# Altium project extension.PrjPcb (part 2 of 2)

## Sheet isolated_NO_contacts.SchDoc: foxBMS BMS-Extension
size A3; DocumentNumber: 13; SheetNumber: 13; SheetTotal: 14; Author: Fraunhofer IISB foxBMS Team; REL-DATE: 2017-05-16; VERSION: 1.0.2; GateName_1: G$1; SymbolName_1: FRAME_B_L; LibraryName: foxBMS_BMS-Master_V1.00_A; DeviceSetName: FRAME_B_L; GateName_2: G$2; SymbolName_2: DOCFIELD; SheetDescription: Isolated Normally Open Contacts
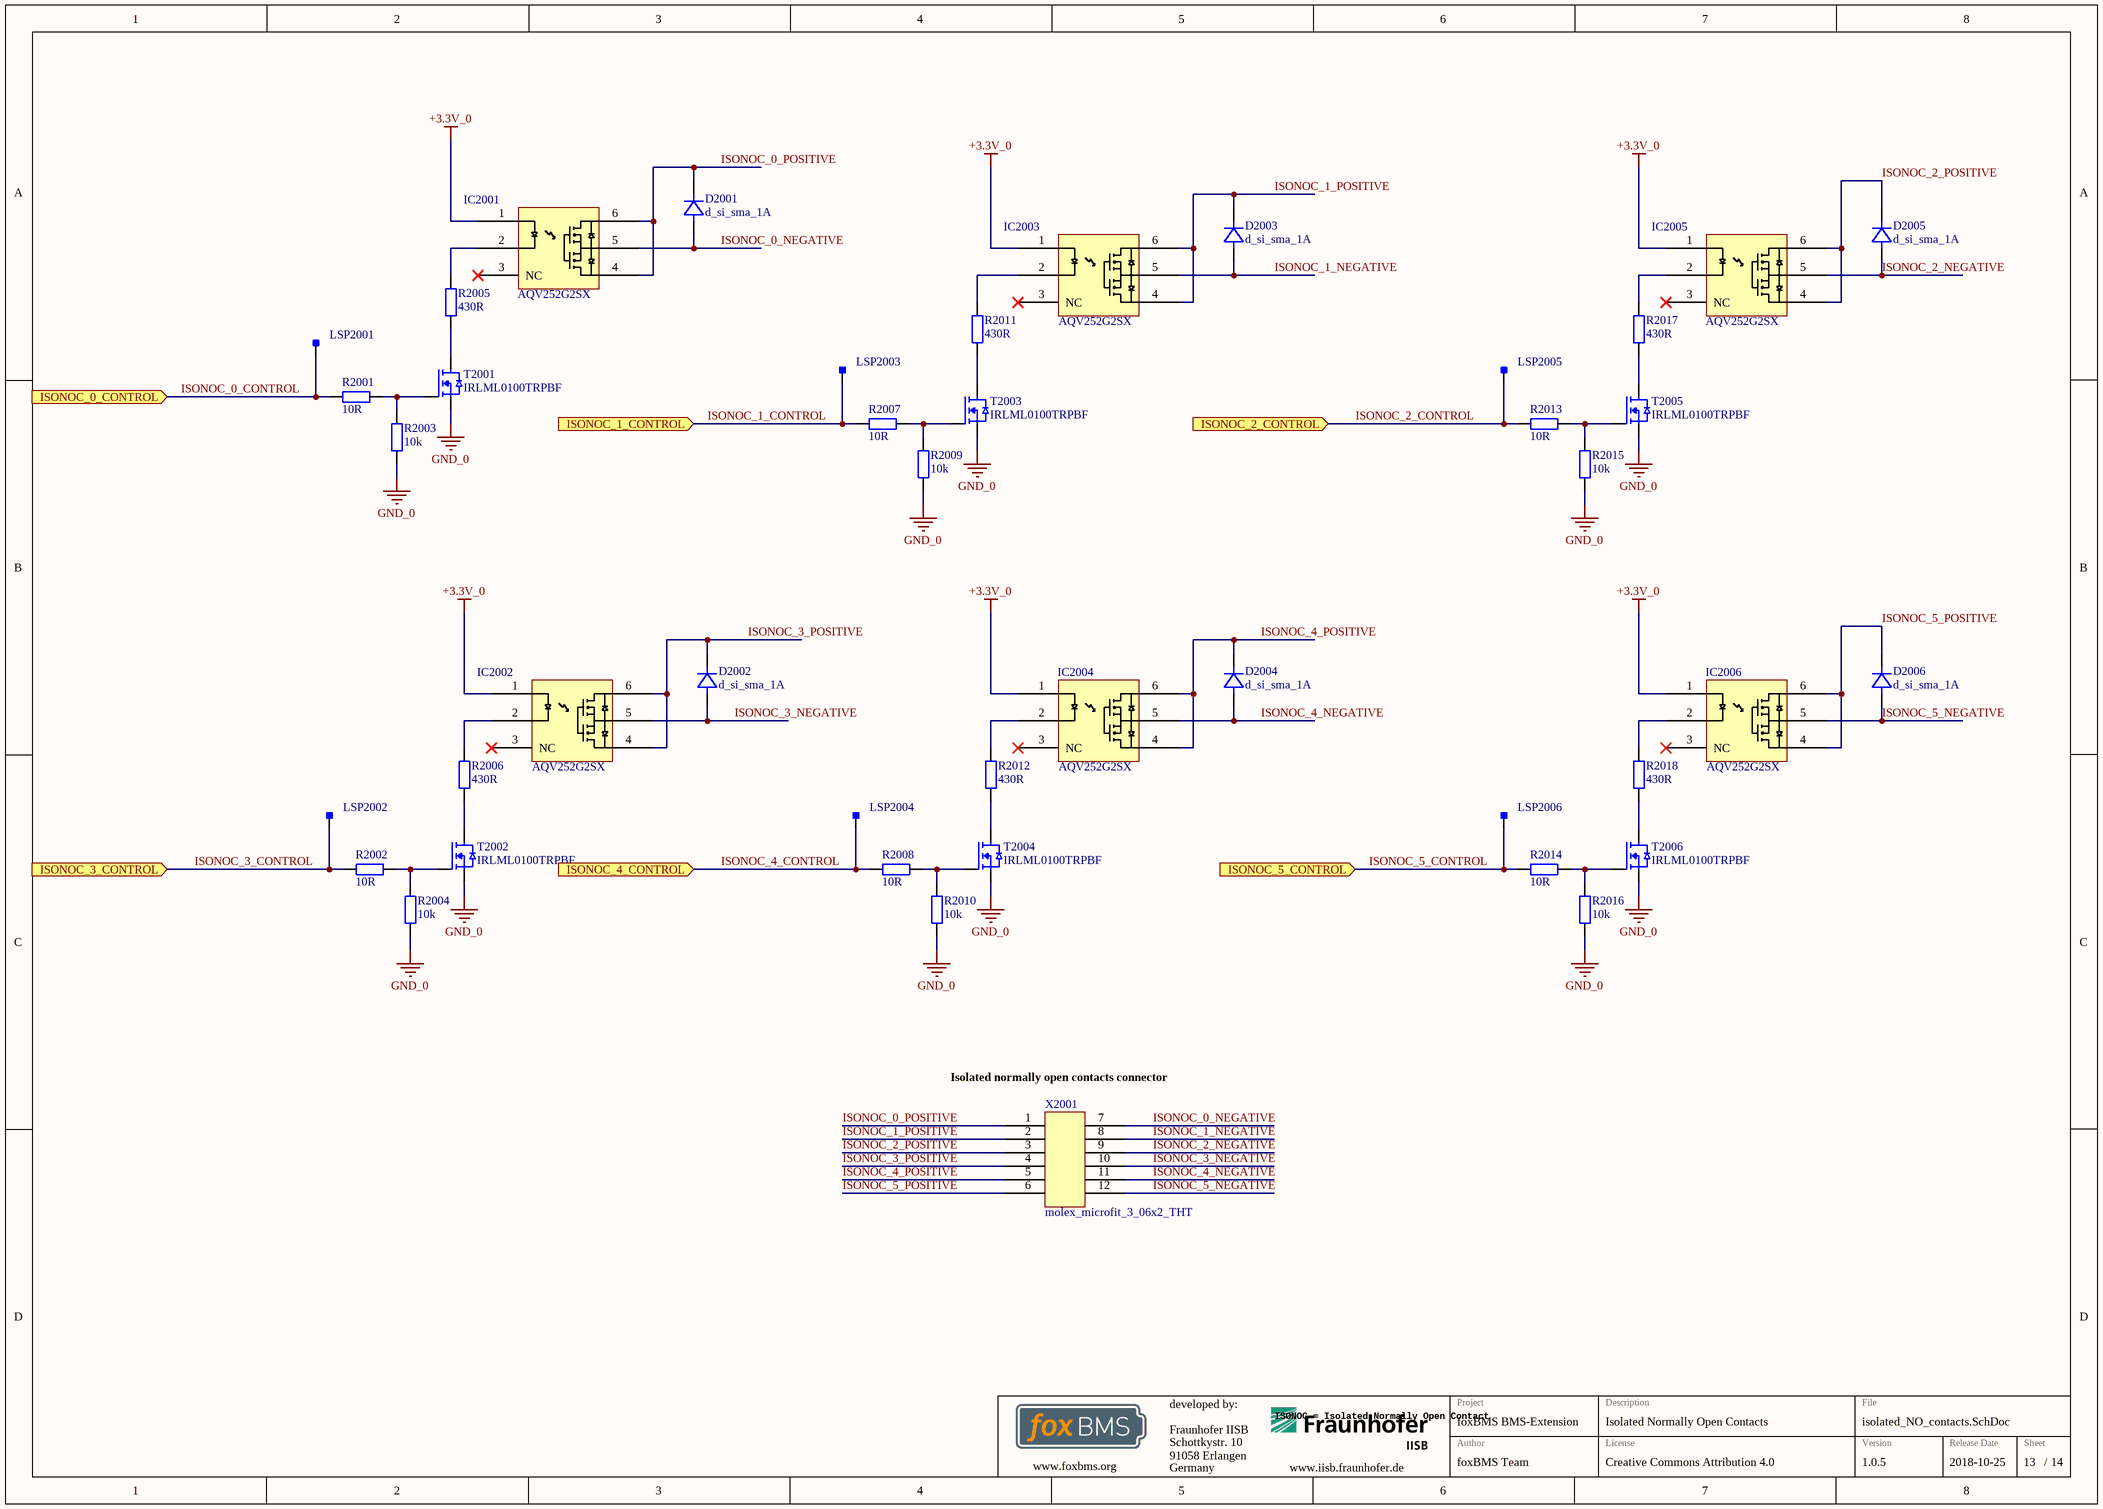
[diagram p7: isolated_NO_contacts.SchDoc]

### Parts
D2001  d_si_sma_1A  [DIOM4326X24N]
D2002  d_si_sma_1A  [DIOM4326X24N]
D2003  d_si_sma_1A  [DIOM4326X24N]
D2004  d_si_sma_1A  [DIOM4326X24N]
D2005  d_si_sma_1A  [DIOM4326X24N]
D2006  d_si_sma_1A  [DIOM4326X24N]
IC2001  AQV252G2SX  [SOP254P680X220-6N]
IC2002  AQV252G2SX  [SOP254P680X220-6N]
IC2003  AQV252G2SX  [SOP254P680X220-6N]
IC2004  AQV252G2SX  [SOP254P680X220-6N]
IC2005  AQV252G2SX  [SOP254P680X220-6N]
IC2006  AQV252G2SX  [SOP254P680X220-6N]
LSP2001  Testpoint_Square  [Testpoint_S1]  (value not drawn)  (no BOM)
LSP2002  Testpoint_Square  [Testpoint_S1]  (value not drawn)  (no BOM)
LSP2003  Testpoint_Square  [Testpoint_S1]  (value not drawn)  (no BOM)
LSP2004  Testpoint_Square  [Testpoint_S1]  (value not drawn)  (no BOM)
LSP2005  Testpoint_Square  [Testpoint_S1]  (value not drawn)  (no BOM)
LSP2006  Testpoint_Square  [Testpoint_S1]  (value not drawn)  (no BOM)
R2001  10R  [RESC1608X05N]
R2002  10R  [RESC1608X05N]
R2003  10k  [RESC1608X05N]
R2004  10k  [RESC1608X05N]
R2005  430R  [RESC1608X05N]
R2006  430R  [RESC1608X05N]
R2007  10R  [RESC1608X05N]
R2008  10R  [RESC1608X05N]
R2009  10k  [RESC1608X05N]
R2010  10k  [RESC1608X05N]
R2011  430R  [RESC1608X05N]
R2012  430R  [RESC1608X05N]
R2013  10R  [RESC1608X05N]
R2014  10R  [RESC1608X05N]
R2015  10k  [RESC1608X05N]
R2016  10k  [RESC1608X05N]
R2017  430R  [RESC1608X05N]
R2018  430R  [RESC1608X05N]
T2001  IRLML0100TRPBF  [SOT95P237X110-3N]
T2002  IRLML0100TRPBF  [SOT95P237X110-3N]
T2003  IRLML0100TRPBF  [SOT95P237X110-3N]
T2004  IRLML0100TRPBF  [SOT95P237X110-3N]
T2005  IRLML0100TRPBF  [SOT95P237X110-3N]
T2006  IRLML0100TRPBF  [SOT95P237X110-3N]
X2001  molex_microfit_3_06x2_THT  [MOLEX_MICROFIT_06x2_THT]

### Ports
ISONOC_0_CONTROL (in), ISONOC_1_CONTROL (in), ISONOC_2_CONTROL (in), ISONOC_3_CONTROL (in), ISONOC_4_CONTROL (in), ISONOC_5_CONTROL (in)

### Nets
+3.3V_0: IC2001.1 IC2002.1 IC2003.1 IC2004.1 IC2005.1 IC2006.1
GND_0: R2003.1 R2004.1 R2009.1 R2010.1 R2015.1 R2016.1 T2001.S T2002.S T2003.S T2004.S T2005.S T2006.S
ISONOC_0_CONTROL: LSP2001.1 R2001.2 ; port ISONOC_0_CONTROL
ISONOC_0_NEGATIVE: D2001.2(A) IC2001.5 X2001.7
ISONOC_0_POSITIVE: D2001.1(K) IC2001.4 IC2001.6 X2001.1
ISONOC_1_CONTROL: LSP2003.1 R2007.2 ; port ISONOC_1_CONTROL
ISONOC_1_NEGATIVE: D2003.2(A) IC2003.5 X2001.8
ISONOC_1_POSITIVE: D2003.1(K) IC2003.4 IC2003.6 X2001.2
ISONOC_2_CONTROL: LSP2005.1 R2013.2 ; port ISONOC_2_CONTROL
ISONOC_2_NEGATIVE: D2005.2(A) IC2005.5 X2001.9
ISONOC_2_POSITIVE: D2005.1(K) IC2005.4 IC2005.6 X2001.3
ISONOC_3_CONTROL: LSP2002.1 R2002.2 ; port ISONOC_3_CONTROL
ISONOC_3_NEGATIVE: D2002.2(A) IC2002.5 X2001.10
ISONOC_3_POSITIVE: D2002.1(K) IC2002.4 IC2002.6 X2001.4
ISONOC_4_CONTROL: LSP2004.1 R2008.2 ; port ISONOC_4_CONTROL
ISONOC_4_NEGATIVE: D2004.2(A) IC2004.5 X2001.11
ISONOC_4_POSITIVE: D2004.1(K) IC2004.4 IC2004.6 X2001.5
ISONOC_5_CONTROL: LSP2006.1 R2014.2 ; port ISONOC_5_CONTROL
ISONOC_5_NEGATIVE: D2006.2(A) IC2006.5 X2001.12
ISONOC_5_POSITIVE: D2006.1(K) IC2006.4 IC2006.6 X2001.6
NetIC2001_2: IC2001.2 R2005.2
NetIC2002_2: IC2002.2 R2006.2
NetIC2003_2: IC2003.2 R2011.2
NetIC2004_2: IC2004.2 R2012.2
NetIC2005_2: IC2005.2 R2017.2
NetIC2006_2: IC2006.2 R2018.2
NetR2001_1: R2001.1 R2003.2 T2001.G
NetR2002_1: R2002.1 R2004.2 T2002.G
NetR2005_1: R2005.1 T2001.D
NetR2006_1: R2006.1 T2002.D
NetR2007_1: R2007.1 R2009.2 T2003.G
NetR2008_1: R2008.1 R2010.2 T2004.G
NetR2011_1: R2011.1 T2003.D
NetR2012_1: R2012.1 T2004.D
NetR2013_1: R2013.1 R2015.2 T2005.G
NetR2014_1: R2014.1 R2016.2 T2006.G
NetR2017_1: R2017.1 T2005.D
NetR2018_1: R2018.1 T2006.D

Not connected (* = marked no-connect by the designer): IC2001 3(NC)*; IC2002 3(NC)*; IC2003 3(NC)*; IC2004 3(NC)*; IC2005 3(NC)*; IC2006 3(NC)*

### Notes on the sheet
- (near X2001) Isolated normally open contacts connector
- ISONOC = Isolated Normally Open Contact
- Fraunhofer IISB
- Schottkystr. 10
- developed by:
- 91058 Erlangen
- Germany
- Author
- Project
- License
- Description
- File
- Version
- Release Date
- Sheet
- www.foxbms.org
- www.iisb.fraunhofer.de
- foxBMS Team
- /

### Library data of the parts
D2001-D2006 = d_si_sma_1A: Standard Recovery Diode, 100 V, 1 A, Single, 1 V, 2 µs, 30 A; Part Name: GF1B; Manufacturer: ON Semiconductor; Breakdown Voltage: 100V; Continuous Forward Current: 1A; Part Number: d_si_sma_1A; Operating Temperature: -65°C - +175°C; ComponentLink1Description: Datasheet; ComponentLink1URL: http://www.farnell.com/datasheets/2303965.pdf; Supplier 1: Farnell; Supplier Part Number 1: 1467477
IC2001-IC2006 = AQV252G2SX: PhotoMOS Relay; Manufacturer: Panasonic; Part Number: AQV252G2SX; Part Name: AQV252G2SX; Operating Temperature: -40°C - +85°C; Supplier 1: Digikey; Supplier Part Number 1: 255-3594-1-ND; Supplier 2: Farnell; Supplier Part Number 2: 2302216
LSP2001-LSP2006 = Testpoint_Square: Testpoint, square; Part Number: Testpoint_Square
R2001 R2002 R2007 R2008 R2013 R2014 = gen_R_10R_0603: SMD Resistor 10R 0603; Tolerance: 1%; Power: 0.1W; Case EIA: 0603; Case Metric: 1608; Maximum Working Voltage: 75V; PnP Package: R_0603; Part Number: gen_R_10R_0603; Operating Temperature: -55°C - +155°C; Resistance: 10R; Series: E24, E96; PnP Value: 10R; Supplier 1: Farnell; Supplier Part Number 1: 2073361
R2003 R2004 R2009 R2010 R2015 R2016 = gen_R_10k_0603: as R803 on sheet CAN_1; Part Number: gen_R_10k_0603; Operating Temperature: -55°C - +155°C; Resistance: 10k; Series: E24, E96; PnP Value: 10k; Supplier 1: Farnell; Supplier Part Number 1: 2073349
R2005 R2006 R2011 R2012 R2017 R2018 = gen_R_430R_0603: SMD Resistor 430R 0603; Tolerance: 1%; Power: 0.1W; Case EIA: 0603; Case Metric: 1608; Maximum Working Voltage: 75V; PnP Package: R_0603; Part Number: gen_R_430R_0603; Operating Temperature: -55°C - +155°C; Resistance: 430R; Series: E24; PnP Value: 430R; Supplier 1: Farnell; Supplier Part Number 1: 2074259
T2001-T2006 = IRLML0100TRPBF: MOSFET-Transistor, n-Kanal, 1.6 A, 100 V, 0.178 ohm, 10 V, 2.5 V; Manufacturer: Infineon; Maximum Drain-Source Voltage: 100V; Maximum Continous Drain Current (25°C): 1.6A; R_DS(on): 190m; Total Gate Charge: 2.5nC; Part Number: IRLML0100TRPBF; Part Name: NMOS; Operating Temperature: -55°C - +150°C; ComponentLink1Description: Datasheet URL; ComponentLink1URL: http://www.farnell.com/datasheets/491501.pdf; Supplier 1: Farnell; Supplier Part Number 1: 1783928
X2001 = molex_microfit_3_06x2_THT: Micro-Fit 3.0 Right Angle Header, 3.00mm Pitch, Dual Row, 12 Circuits, with Snap-in Plastic Peg PCB Lock, Tin, Glow Wire Capable, Black, 43045-1200; Manufacturer: Molex; Circuits: 12; Rated Voltage: 600V; Rated Current: 8.5A; Part Number: molex_microfit_3_06x2_THT; Part Name: MicroFit; Operating Temperature: -40°C - +105°C; Supplier 1: Farnell; Supplier Part Number 1: 9732977

## Sheet FPGA_SPI_interface.SchDoc: foxBMS BMS-Extension
size A3; DocumentNumber: 14; SheetNumber: 14; SheetTotal: 14; Author: Fraunhofer IISB foxBMS Team; REL-DATE: 2017-05-16; VERSION: 1.0.2; GateName_1: G$1; SymbolName_1: FRAME_B_L; LibraryName: foxBMS_BMS-Master_V1.00_A; DeviceSetName: FRAME_B_L; GateName_2: G$2; SymbolName_2: DOCFIELD; SheetDescription: FPGA SPI Interface up to 45MHz
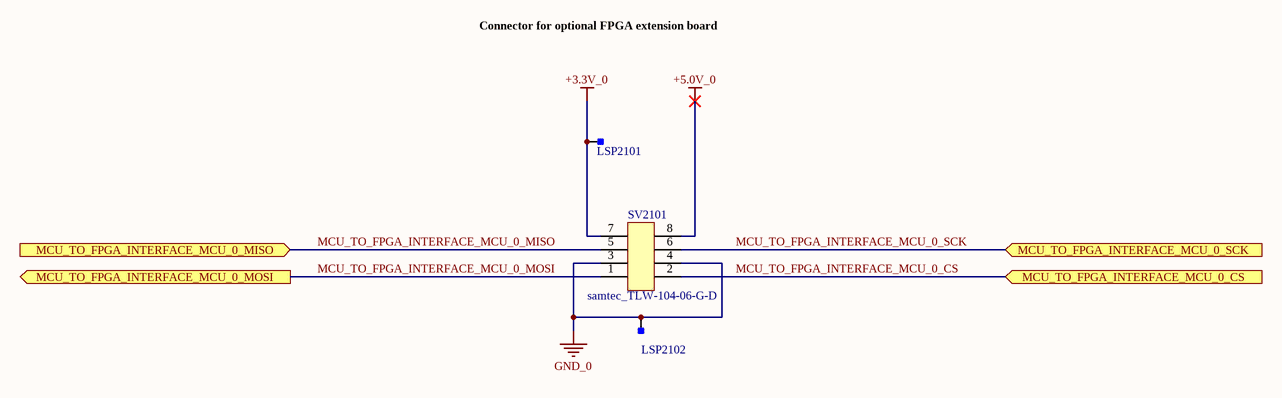
[diagram p8: FPGA_SPI_interface.SchDoc]

### Parts
LSP2101  Testpoint_Square  [Testpoint_S1]  (value not drawn)  (no BOM)
LSP2102  Testpoint_Square  [Testpoint_S1]  (value not drawn)  (no BOM)
SV2101  samtec_TLW-104-06-G-D  [Pinheader_2.54_2x4]

### Ports
MCU_TO_FPGA_INTERFACE_MCU_0_CS (in), MCU_TO_FPGA_INTERFACE_MCU_0_MISO (in), MCU_TO_FPGA_INTERFACE_MCU_0_MOSI (out), MCU_TO_FPGA_INTERFACE_MCU_0_SCK (in)

### Nets
+3.3V_0: LSP2101.1 SV2101.7
+5.0V_0: SV2101.8
GND_0: LSP2102.1 SV2101.3 SV2101.4
MCU_TO_FPGA_INTERFACE_MCU_0_CS: SV2101.2 ; port MCU_TO_FPGA_INTERFACE_MCU_0_CS
MCU_TO_FPGA_INTERFACE_MCU_0_MISO: SV2101.5 ; port MCU_TO_FPGA_INTERFACE_MCU_0_MISO
MCU_TO_FPGA_INTERFACE_MCU_0_MOSI: SV2101.1 ; port MCU_TO_FPGA_INTERFACE_MCU_0_MOSI
MCU_TO_FPGA_INTERFACE_MCU_0_SCK: SV2101.6 ; port MCU_TO_FPGA_INTERFACE_MCU_0_SCK

### Notes on the sheet
- Connector for optional FPGA extension board
- Fraunhofer IISB
- Schottkystr. 10
- developed by:
- 91058 Erlangen
- Germany
- Author
- Project
- License
- Description
- File
- Version
- Release Date
- Sheet
- www.foxbms.org
- www.iisb.fraunhofer.de
- foxBMS Team
- /

### Library data of the parts
LSP2101 LSP2102 = Testpoint_Square: Testpoint, square; Part Number: Testpoint_Square
SV2101 = samtec_TLW-104-06-G-D: Board-To-Board Connector, Vertical, Low Profile, 2.54 mm, 8 Contacts, Header, TLW Series, Through Hole, 2 Rows; Manufacturer: Samtec; Circuits: 8; Part Number: samtec_TLW-104-06-G-D; Part Name: TLW-104-06-G-D; Operating Temperature: -55°C - +125°C; ComponentLink1Description: Datasheet; ComponentLink1URL: http://suddendocs.samtec.com/catalog_english/tlw_th.pdf; Supplier 1: Digikey; Supplier Part Number 1: SAM1096-04-ND

## Sheet connectors_to_BMS_master.SchDoc: foxBMS BMS-Extension
size A3; DocumentNumber: 2; SheetNumber: 2; SheetTotal: 14; Author: Fraunhofer IISB foxBMS Team; REL-DATE: 2017-05-16; VERSION: 1.0.2; GateName_1: G$1; SymbolName_1: FRAME_B_L; LibraryName: foxBMS_BMS-Master_V1.00_A; DeviceSetName: FRAME_B_L; GateName_2: G$2; SymbolName_2: DOCFIELD; SheetDescription: Connectors to BMS-Master
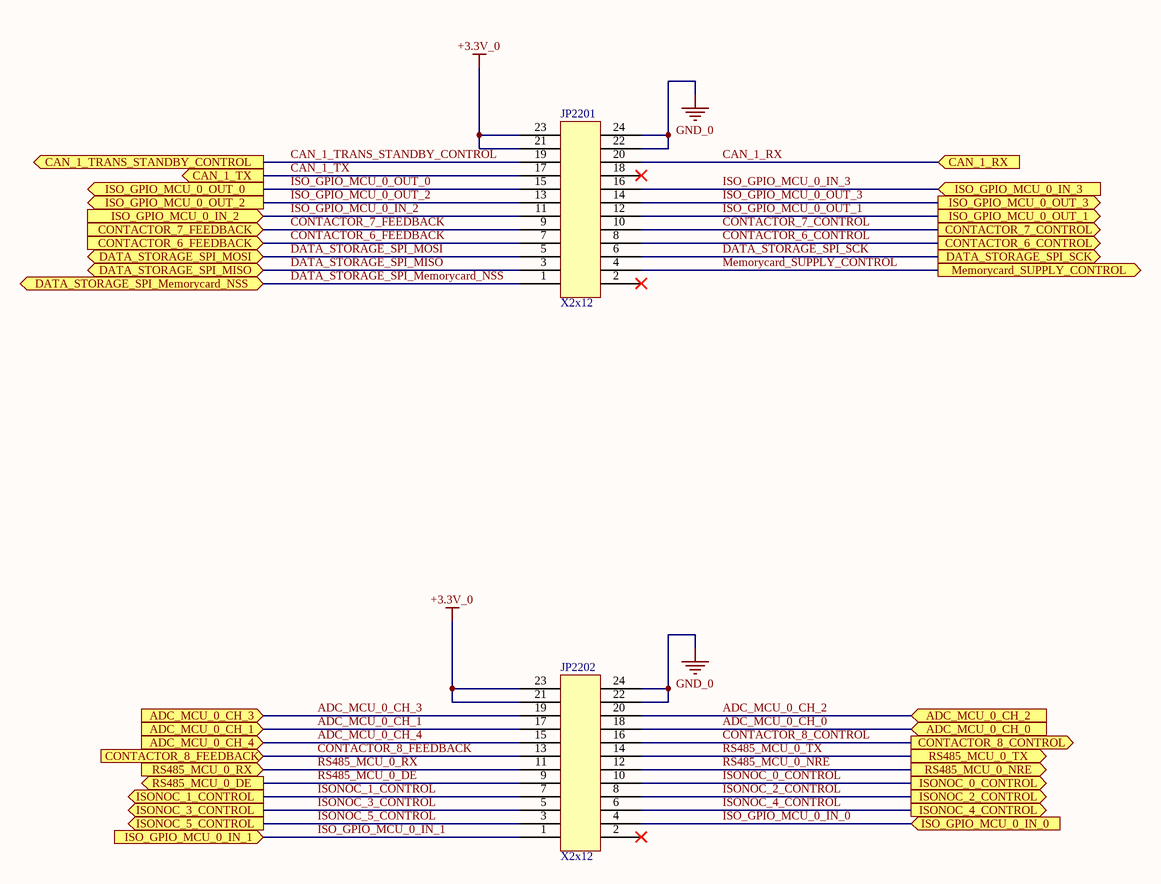
[diagram p9: connectors_to_BMS_master.SchDoc]

### Parts
JP2201  X2x12  [Pinheader_2.54_2x12]
JP2202  X2x12  [Pinheader_2.54_2x12]

### Ports
ADC_MCU_0_CH_0 (in), ADC_MCU_0_CH_1 (in), ADC_MCU_0_CH_2 (in), ADC_MCU_0_CH_3 (in), ADC_MCU_0_CH_4 (in), CAN_1_RX (in), CAN_1_TRANS_STANDBY_CONTROL (out), CAN_1_TX (out), CONTACTOR_6_CONTROL (out), CONTACTOR_6_FEEDBACK (in), CONTACTOR_7_CONTROL (out), CONTACTOR_7_FEEDBACK (in), CONTACTOR_8_CONTROL (out), CONTACTOR_8_FEEDBACK (in), DATA_STORAGE_SPI_Memorycard_NSS (bidir), DATA_STORAGE_SPI_MISO (bidir), DATA_STORAGE_SPI_MOSI (bidir), DATA_STORAGE_SPI_SCK (out), ISO_GPIO_MCU_0_IN_0 (in), ISO_GPIO_MCU_0_IN_1 (in), ISO_GPIO_MCU_0_IN_2 (in), ISO_GPIO_MCU_0_IN_3 (in), ISO_GPIO_MCU_0_OUT_0 (out), ISO_GPIO_MCU_0_OUT_1 (out), ISO_GPIO_MCU_0_OUT_2 (out), ISO_GPIO_MCU_0_OUT_3 (out), ISONOC_0_CONTROL (out), ISONOC_1_CONTROL (out), ISONOC_2_CONTROL (out), ISONOC_3_CONTROL (out), ISONOC_4_CONTROL (out), ISONOC_5_CONTROL (out), Memorycard_SUPPLY_CONTROL (out), RS485_MCU_0_DE (out), RS485_MCU_0_NRE (out), RS485_MCU_0_RX (in), RS485_MCU_0_TX (out)

### Nets
+3.3V_0: JP2201.21 JP2201.23 JP2202.21 JP2202.23
GND_0: JP2201.22 JP2201.24 JP2202.22 JP2202.24
ADC_MCU_0_CH_0: JP2202.18 ; port ADC_MCU_0_CH_0
ADC_MCU_0_CH_1: JP2202.17 ; port ADC_MCU_0_CH_1
ADC_MCU_0_CH_2: JP2202.20 ; port ADC_MCU_0_CH_2
ADC_MCU_0_CH_3: JP2202.19 ; port ADC_MCU_0_CH_3
ADC_MCU_0_CH_4: JP2202.15 ; port ADC_MCU_0_CH_4
CAN_1_RX: JP2201.20 ; port CAN_1_RX
CAN_1_TRANS_STANDBY_CONTROL: JP2201.19 ; port CAN_1_TRANS_STANDBY_CONTROL
CAN_1_TX: JP2201.17 ; port CAN_1_TX
CONTACTOR_6_CONTROL: JP2201.8 ; port CONTACTOR_6_CONTROL
CONTACTOR_6_FEEDBACK: JP2201.7 ; port CONTACTOR_6_FEEDBACK
CONTACTOR_7_CONTROL: JP2201.10 ; port CONTACTOR_7_CONTROL
CONTACTOR_7_FEEDBACK: JP2201.9 ; port CONTACTOR_7_FEEDBACK
CONTACTOR_8_CONTROL: JP2202.16 ; port CONTACTOR_8_CONTROL
CONTACTOR_8_FEEDBACK: JP2202.13 ; port CONTACTOR_8_FEEDBACK
DATA_STORAGE_SPI_Memorycard_NSS: JP2201.1 ; port DATA_STORAGE_SPI_Memorycard_NSS
DATA_STORAGE_SPI_MISO: JP2201.3 ; port DATA_STORAGE_SPI_MISO
DATA_STORAGE_SPI_MOSI: JP2201.5 ; port DATA_STORAGE_SPI_MOSI
DATA_STORAGE_SPI_SCK: JP2201.6 ; port DATA_STORAGE_SPI_SCK
ISO_GPIO_MCU_0_IN_0: JP2202.4 ; port ISO_GPIO_MCU_0_IN_0
ISO_GPIO_MCU_0_IN_1: JP2202.1 ; port ISO_GPIO_MCU_0_IN_1
ISO_GPIO_MCU_0_IN_2: JP2201.11 ; port ISO_GPIO_MCU_0_IN_2
ISO_GPIO_MCU_0_IN_3: JP2201.16 ; port ISO_GPIO_MCU_0_IN_3
ISO_GPIO_MCU_0_OUT_0: JP2201.15 ; port ISO_GPIO_MCU_0_OUT_0
ISO_GPIO_MCU_0_OUT_1: JP2201.12 ; port ISO_GPIO_MCU_0_OUT_1
ISO_GPIO_MCU_0_OUT_2: JP2201.13 ; port ISO_GPIO_MCU_0_OUT_2
ISO_GPIO_MCU_0_OUT_3: JP2201.14 ; port ISO_GPIO_MCU_0_OUT_3
ISONOC_0_CONTROL: JP2202.10 ; port ISONOC_0_CONTROL
ISONOC_1_CONTROL: JP2202.7 ; port ISONOC_1_CONTROL
ISONOC_2_CONTROL: JP2202.8 ; port ISONOC_2_CONTROL
ISONOC_3_CONTROL: JP2202.5 ; port ISONOC_3_CONTROL
ISONOC_4_CONTROL: JP2202.6 ; port ISONOC_4_CONTROL
ISONOC_5_CONTROL: JP2202.3 ; port ISONOC_5_CONTROL
Memorycard_SUPPLY_CONTROL: JP2201.4 ; port Memorycard_SUPPLY_CONTROL
RS485_MCU_0_DE: JP2202.9 ; port RS485_MCU_0_DE
RS485_MCU_0_NRE: JP2202.12 ; port RS485_MCU_0_NRE
RS485_MCU_0_RX: JP2202.11 ; port RS485_MCU_0_RX
RS485_MCU_0_TX: JP2202.14 ; port RS485_MCU_0_TX

Not connected (* = marked no-connect by the designer): JP2201 2* 18*; JP2202 2*

### Notes on the sheet
- Fraunhofer IISB
- Schottkystr. 10
- developed by:
- 91058 Erlangen
- Germany
- Author
- Project
- License
- Description
- File
- Version
- Release Date
- Sheet
- www.foxbms.org
- www.iisb.fraunhofer.de
- foxBMS Team
- /

### Library data of the parts
JP2201 JP2202 = samtec_TLW-112-06-G-D: Board-To-Board Connector, Vertical, Low Profile, 2.54 mm, 24 Contacts, Header, TLW Series, Through Hole, 2 Rows; Manufacturer: Samtec; Circuits: 24; Part Number: samtec_TLW-112-06-G-D; Part Name: TLW-112-06-G-D; Operating Temperature: -55°C - +125°C; ComponentLink1Description: Datasheet; ComponentLink1URL: http://suddendocs.samtec.com/catalog_english/tlw_th.pdf; Supplier 1: Digikey; Supplier Part Number 1: SAM1096-12-ND

## Sheet contactors_6_to_8.SchDoc
size A3; DocumentNumber: 3; SheetNumber: 3; SheetTotal: 14; SheetDescription: Contactors 6-8
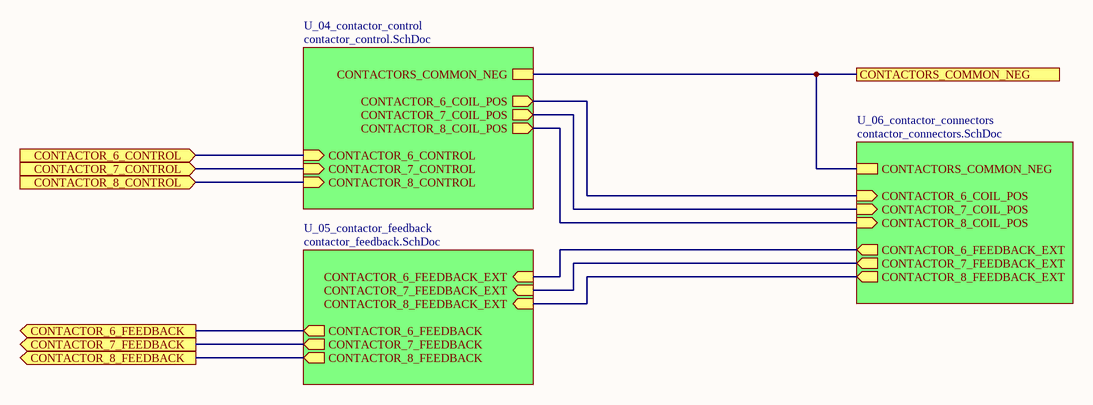
[diagram p10: contactors_6_to_8.SchDoc]

### Sub-sheets
U_04_contactor_control = contactor_control.SchDoc: CONTACTORS_COMMON_NEG, CONTACTOR_6_COIL_POS (out), CONTACTOR_7_COIL_POS (out), CONTACTOR_8_COIL_POS (out), CONTACTOR_6_CONTROL (in), CONTACTOR_7_CONTROL (in), CONTACTOR_8_CONTROL (in)
U_05_contactor_feedback = contactor_feedback.SchDoc: CONTACTOR_6_FEEDBACK_EXT (in), CONTACTOR_7_FEEDBACK_EXT (in), CONTACTOR_8_FEEDBACK_EXT (in), CONTACTOR_6_FEEDBACK (out), CONTACTOR_7_FEEDBACK (out), CONTACTOR_8_FEEDBACK (out)
U_06_contactor_connectors = contactor_connectors.SchDoc: CONTACTORS_COMMON_NEG, CONTACTOR_6_COIL_POS (in), CONTACTOR_6_FEEDBACK_EXT (out), CONTACTOR_7_COIL_POS (in), CONTACTOR_7_FEEDBACK_EXT (out), CONTACTOR_8_COIL_POS (in), CONTACTOR_8_FEEDBACK_EXT (out)

### Ports
CONTACTOR_6_CONTROL (in), CONTACTOR_6_FEEDBACK (out), CONTACTOR_7_CONTROL (in), CONTACTOR_7_FEEDBACK (out), CONTACTOR_8_CONTROL (in), CONTACTOR_8_FEEDBACK (out), CONTACTORS_COMMON_NEG

### Nets
CONTACTOR_6_COIL_POS: sheet U_04_contactor_control/CONTACTOR_6_COIL_POS, sheet U_06_contactor_connectors/CONTACTOR_6_COIL_POS
CONTACTOR_6_CONTROL: port CONTACTOR_6_CONTROL, sheet U_04_contactor_control/CONTACTOR_6_CONTROL
CONTACTOR_6_FEEDBACK: port CONTACTOR_6_FEEDBACK, sheet U_05_contactor_feedback/CONTACTOR_6_FEEDBACK
CONTACTOR_6_FEEDBACK_EXT: sheet U_05_contactor_feedback/CONTACTOR_6_FEEDBACK_EXT, sheet U_06_contactor_connectors/CONTACTOR_6_FEEDBACK_EXT
CONTACTOR_7_COIL_POS: sheet U_04_contactor_control/CONTACTOR_7_COIL_POS, sheet U_06_contactor_connectors/CONTACTOR_7_COIL_POS
CONTACTOR_7_CONTROL: port CONTACTOR_7_CONTROL, sheet U_04_contactor_control/CONTACTOR_7_CONTROL
CONTACTOR_7_FEEDBACK: port CONTACTOR_7_FEEDBACK, sheet U_05_contactor_feedback/CONTACTOR_7_FEEDBACK
CONTACTOR_7_FEEDBACK_EXT: sheet U_05_contactor_feedback/CONTACTOR_7_FEEDBACK_EXT, sheet U_06_contactor_connectors/CONTACTOR_7_FEEDBACK_EXT
CONTACTOR_8_COIL_POS: sheet U_04_contactor_control/CONTACTOR_8_COIL_POS, sheet U_06_contactor_connectors/CONTACTOR_8_COIL_POS
CONTACTOR_8_CONTROL: port CONTACTOR_8_CONTROL, sheet U_04_contactor_control/CONTACTOR_8_CONTROL
CONTACTOR_8_FEEDBACK: port CONTACTOR_8_FEEDBACK, sheet U_05_contactor_feedback/CONTACTOR_8_FEEDBACK
CONTACTOR_8_FEEDBACK_EXT: sheet U_05_contactor_feedback/CONTACTOR_8_FEEDBACK_EXT, sheet U_06_contactor_connectors/CONTACTOR_8_FEEDBACK_EXT
CONTACTORS_COMMON_NEG: port CONTACTORS_COMMON_NEG, sheet U_04_contactor_control/CONTACTORS_COMMON_NEG, sheet U_06_contactor_connectors/CONTACTORS_COMMON_NEG

### Notes on the sheet
- Fraunhofer IISB
- Schottkystr. 10
- developed by:
- 91058 Erlangen
- Germany
- Author
- Project
- License
- Description
- File
- Version
- Release Date
- Sheet
- www.foxbms.org
- www.iisb.fraunhofer.de
- foxBMS Team
- /

## Sheet contactor_control.SchDoc: foxBMS BMS-Extension
size A3; DocumentNumber: 4; SheetNumber: 4; SheetTotal: 14; Author: Fraunhofer IISB foxBMS Team; REL-DATE: 2017-05-16; VERSION: 1.0.2; GateName_1: G$1; SymbolName_1: FRAME_B_L; LibraryName: foxBMS_BMS-Master_V1.00_A; DeviceSetName: FRAME_B_L; GateName_2: G$2; SymbolName_2: DOCFIELD; SheetDescription: Contactor Control
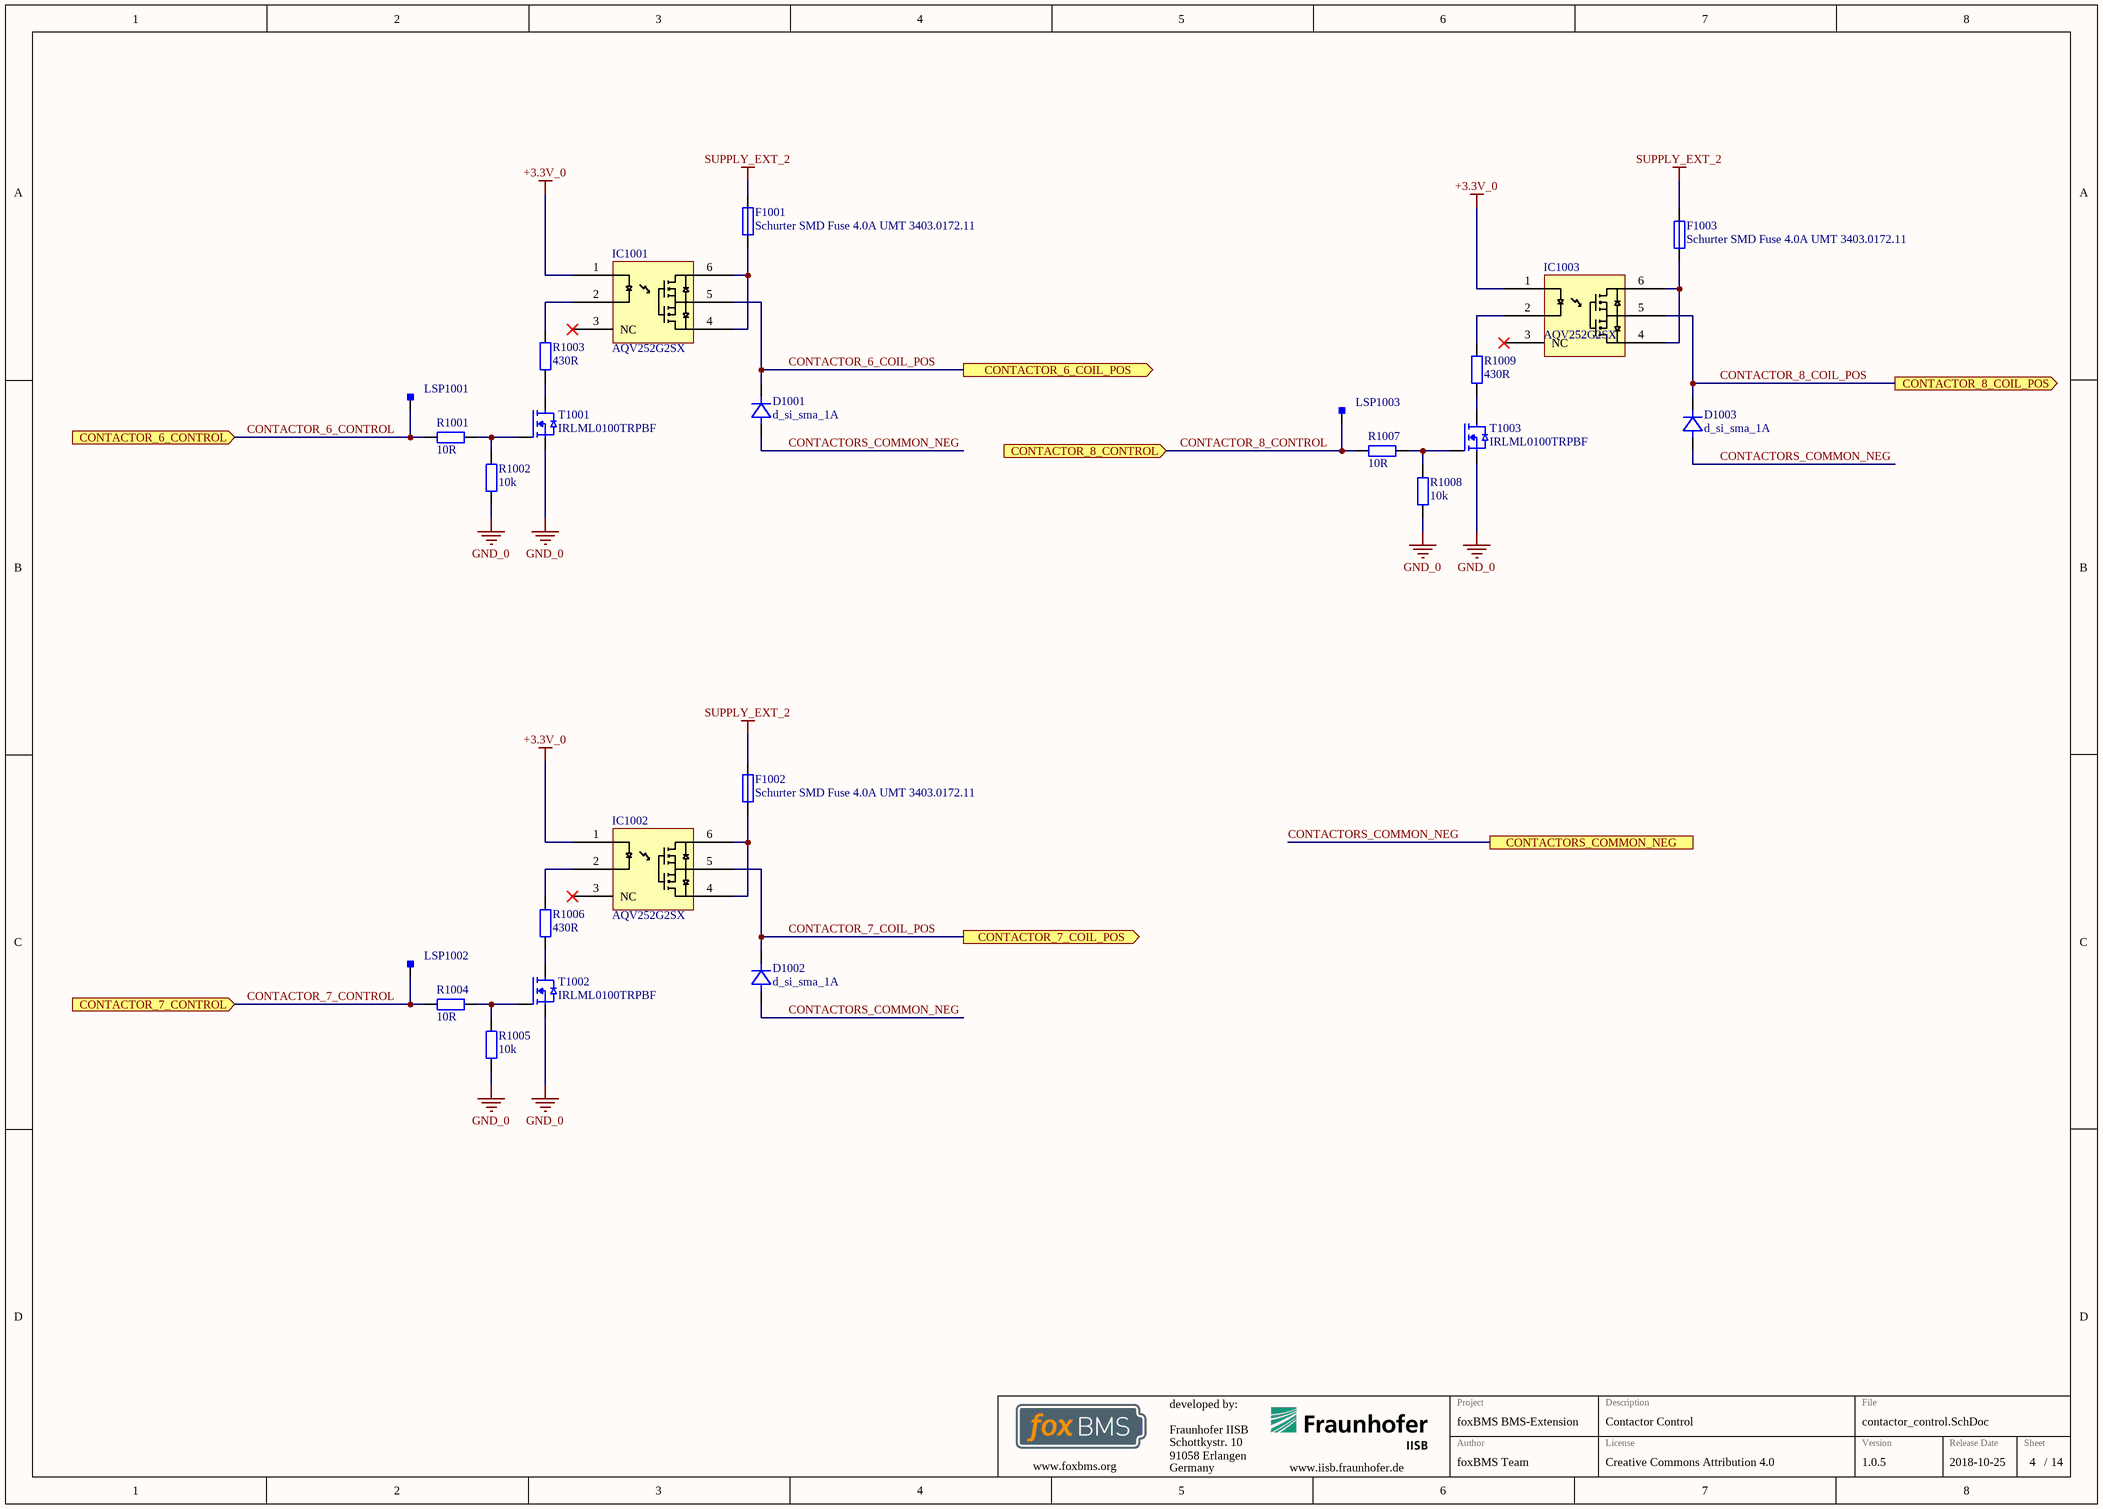
[diagram p11: contactor_control.SchDoc]

### Parts
D1001  d_si_sma_1A  [DIOM4326X24N]
D1002  d_si_sma_1A  [DIOM4326X24N]
D1003  d_si_sma_1A  [DIOM4326X24N]
F1001  Schurter SMD Fuse 4.0A UMT 3403.0172.11  [Schurter_UMT_250]
F1002  Schurter SMD Fuse 4.0A UMT 3403.0172.11  [Schurter_UMT_250]
F1003  Schurter SMD Fuse 4.0A UMT 3403.0172.11  [Schurter_UMT_250]
IC1001  AQV252G2SX  [SOP254P680X220-6N]
IC1002  AQV252G2SX  [SOP254P680X220-6N]
IC1003  AQV252G2SX  [SOP254P680X220-6N]
LSP1001  Testpoint_Square  [Testpoint_S1]  (value not drawn)  (no BOM)
LSP1002  Testpoint_Square  [Testpoint_S1]  (value not drawn)  (no BOM)
LSP1003  Testpoint_Square  [Testpoint_S1]  (value not drawn)  (no BOM)
R1001  10R  [RESC1608X05N]
R1002  10k  [RESC1608X05N]
R1003  430R  [RESC1608X05N]
R1004  10R  [RESC1608X05N]
R1005  10k  [RESC1608X05N]
R1006  430R  [RESC1608X05N]
R1007  10R  [RESC1608X05N]
R1008  10k  [RESC1608X05N]
R1009  430R  [RESC1608X05N]
T1001  IRLML0100TRPBF  [SOT95P237X110-3N]
T1002  IRLML0100TRPBF  [SOT95P237X110-3N]
T1003  IRLML0100TRPBF  [SOT95P237X110-3N]

### Ports
CONTACTOR_6_COIL_POS (out), CONTACTOR_6_CONTROL (in), CONTACTOR_7_COIL_POS (out), CONTACTOR_7_CONTROL (in), CONTACTOR_8_COIL_POS (out), CONTACTOR_8_CONTROL (in), CONTACTORS_COMMON_NEG

### Nets
+3.3V_0: IC1001.1 IC1002.1 IC1003.1
GND_0: R1002.1 R1005.1 R1008.1 T1001.S T1002.S T1003.S
SUPPLY_EXT_2: F1001.2 F1002.2 F1003.2
CONTACTOR_6_COIL_POS: D1001.1(K) IC1001.5 ; port CONTACTOR_6_COIL_POS
CONTACTOR_6_CONTROL: LSP1001.1 R1001.2 ; port CONTACTOR_6_CONTROL
CONTACTOR_7_COIL_POS: D1002.1(K) IC1002.5 ; port CONTACTOR_7_COIL_POS
CONTACTOR_7_CONTROL: LSP1002.1 R1004.2 ; port CONTACTOR_7_CONTROL
CONTACTOR_8_COIL_POS: D1003.1(K) IC1003.5 ; port CONTACTOR_8_COIL_POS
CONTACTOR_8_CONTROL: LSP1003.1 R1007.2 ; port CONTACTOR_8_CONTROL
CONTACTORS_COMMON_NEG: D1001.2(A) D1002.2(A) D1003.2(A) ; port CONTACTORS_COMMON_NEG
NetF1001_1: F1001.1 IC1001.4 IC1001.6
NetF1002_1: F1002.1 IC1002.4 IC1002.6
NetF1003_1: F1003.1 IC1003.4 IC1003.6
NetIC1001_2: IC1001.2 R1003.2
NetIC1002_2: IC1002.2 R1006.2
NetIC1003_2: IC1003.2 R1009.2
NetR1001_1: R1001.1 R1002.2 T1001.G
NetR1003_1: R1003.1 T1001.D
NetR1004_1: R1004.1 R1005.2 T1002.G
NetR1006_1: R1006.1 T1002.D
NetR1007_1: R1007.1 R1008.2 T1003.G
NetR1009_1: R1009.1 T1003.D

Not connected (* = marked no-connect by the designer): IC1001 3(NC)*; IC1002 3(NC)*; IC1003 3(NC)*

### Notes on the sheet
- Fraunhofer IISB
- Schottkystr. 10
- developed by:
- 91058 Erlangen
- Germany
- Author
- Project
- License
- Description
- File
- Version
- Release Date
- Sheet
- www.foxbms.org
- www.iisb.fraunhofer.de
- foxBMS Team
- /

### Library data of the parts
D1001-D1003 = d_si_sma_1A: as D2001 on sheet isolated_NO_contacts; Part Number: d_si_sma_1A; Operating Temperature: -65°C - +175°C; ComponentLink1Description: Datasheet; ComponentLink1URL: http://www.farnell.com/datasheets/2303965.pdf; Supplier 1: Farnell; Supplier Part Number 1: 1467477
F1001-F1003 = fuse_4A_3403.0172.11: Part Number: fuse_4A_3403.0172.11; Manufacturer: Schurter; Operating Temperature: -55°C - +125°C; ComponentLink1Description: Catalog Page Digikey; ComponentLink1URL: http://dkc3.digikey.com/PDF/DE2011-DE/P2352.pdf; Supplier 1: Digikey; Supplier Part Number 1: 486-1253-ND; Supplier 2: Mouser; Supplier Part Number 2: 693-3403.0172.11
IC1001-IC1003 = AQV252G2SX: PhotoMOS Relay; Manufacturer: Panasonic; Part Number: AQV252G2SX; Part Name: AQV252G2SX; Operating Temperature: -40°C - +85°C; Supplier 1: Digikey; Supplier Part Number 1: 255-3594-1-ND; Supplier 2: Farnell; Supplier Part Number 2: 2302216
LSP1001-LSP1003 = Testpoint_Square: Testpoint, square; Part Number: Testpoint_Square
R1001 R1004 R1007 = gen_R_10R_0603: as R2001 on sheet isolated_NO_contacts; Part Number: gen_R_10R_0603; Operating Temperature: -55°C - +155°C; Resistance: 10R; Series: E24, E96; PnP Value: 10R; Supplier 1: Farnell; Supplier Part Number 1: 2073361
R1002 R1005 = gen_R_10k_0603: as R803 on sheet CAN_1; Part Number: gen_R_10k_0603; Operating Temperature: -55°C - +155°C; Resistance: 10k; Series: E24, E96; PnP Value: 10k; Supplier 1: Farnell; Supplier Part Number 1: 2073349
R1003 R1006 R1009 = gen_R_430R_0603: as R2005 on sheet isolated_NO_contacts; Part Number: gen_R_430R_0603; Operating Temperature: -55°C - +155°C; Resistance: 430R; Series: E24; PnP Value: 430R; Supplier 1: Farnell; Supplier Part Number 1: 2074259
R1008 = gen_R_10k_0603: SMD Resistor 10k 0603; Power: 0.1W; Case EIA: 0603; Case Metric: 1608; PnP Package: R_0603; Tolerance: 1%; Maximum Working Voltage: 75V; Part Number: gen_R_10k_0603; Operating Temperature: -55°C - +155°C; Resistance: 10k; Series: E24, E96; PnP Value: 10k; Supplier 1: Farnell; Supplier Part Number 1: 2073349
T1001-T1003 = IRLML0100TRPBF: as T2001 on sheet isolated_NO_contacts; Part Number: IRLML0100TRPBF; Part Name: NMOS; Operating Temperature: -55°C - +150°C; ComponentLink1Description: Datasheet URL; ComponentLink1URL: http://www.farnell.com/datasheets/491501.pdf; Supplier 1: Farnell; Supplier Part Number 1: 1783928

## Sheet contactor_feedback.SchDoc: foxBMS BMS-Extension
size A3; DocumentNumber: 5; SheetNumber: 5; SheetTotal: 14; Author: Fraunhofer IISB foxBMS Team; REL-DATE: 2017-05-16; VERSION: 1.0.2; GateName_1: G$1; SymbolName_1: FRAME_B_L; LibraryName: foxBMS_BMS-Master_V1.00_A; DeviceSetName: FRAME_B_L; GateName_2: G$2; SymbolName_2: DOCFIELD; SheetDescription: Contactor Feedback
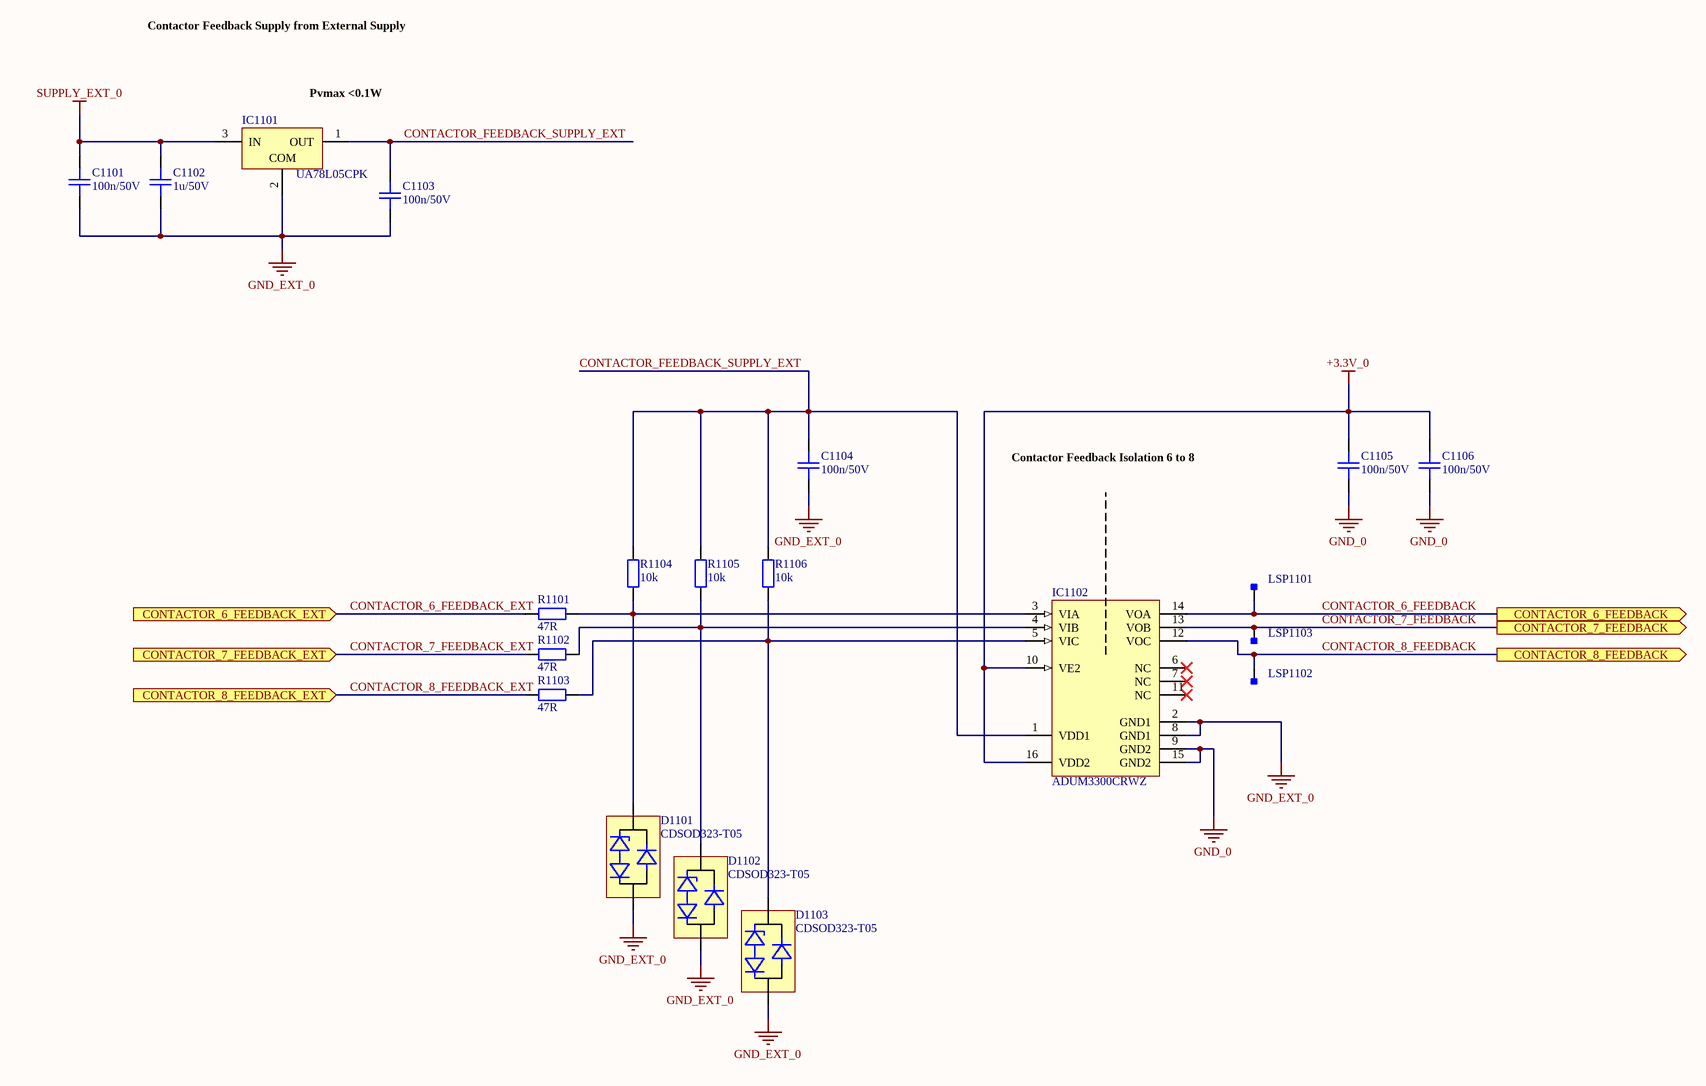
[diagram p12: contactor_feedback.SchDoc]

### Parts
C1101  100n/50V  [CAPC1608X08N]
C1102  1u/50V  [CAPC1608X08N]
C1103  100n/50V  [CAPC1608X08N]
C1104  100n/50V  [CAPC1608X08N]
C1105  100n/50V  [CAPC1608X08N]
C1106  100n/50V  [CAPC1608X08N]
D1101  CDSOD323-T05  [SODFL250X110-2N]
D1102  CDSOD323-T05  [SODFL250X110-2N]
D1103  CDSOD323-T05  [SODFL250X110-2N]
IC1101  UA78L05CPK  [PK0003A_L]
IC1102  ADUM3300CRWZ  [ADI-RW-16_L]
LSP1101  Testpoint_Square  [Testpoint_S1]  (value not drawn)  (no BOM)
LSP1102  Testpoint_Square  [Testpoint_S1]  (value not drawn)  (no BOM)
LSP1103  Testpoint_Square  [Testpoint_S1]  (value not drawn)  (no BOM)
R1101  47R  [RESC1608X05N]
R1102  47R  [RESC1608X05N]
R1103  47R  [RESC1608X05N]
R1104  10k  [RESC1608X05N]
R1105  10k  [RESC1608X05N]
R1106  10k  [RESC1608X05N]

### Ports
CONTACTOR_6_FEEDBACK (out), CONTACTOR_6_FEEDBACK_EXT (in), CONTACTOR_7_FEEDBACK (out), CONTACTOR_7_FEEDBACK_EXT (in), CONTACTOR_8_FEEDBACK (out), CONTACTOR_8_FEEDBACK_EXT (in)

### Nets
+3.3V_0: C1105.1 C1106.1 IC1102.10(VE2) IC1102.16(VDD2)
GND_0: C1105.2 C1106.2 IC1102.9(GND2) IC1102.15(GND2)
GND_EXT_0: C1101.2 C1102.2 C1103.2 C1104.2 D1101.2(A) D1102.2(A) D1103.2(A) IC1101.2(COM) IC1102.2(GND1) IC1102.8(GND1)
SUPPLY_EXT_0: C1101.1 C1102.1 IC1101.3(IN)
CONTACTOR_6_FEEDBACK: IC1102.14(VOA) LSP1101.1 ; port CONTACTOR_6_FEEDBACK
CONTACTOR_6_FEEDBACK_EXT: R1101.2 ; port CONTACTOR_6_FEEDBACK_EXT
CONTACTOR_7_FEEDBACK: IC1102.13(VOB) LSP1103.1 ; port CONTACTOR_7_FEEDBACK
CONTACTOR_7_FEEDBACK_EXT: R1102.2 ; port CONTACTOR_7_FEEDBACK_EXT
CONTACTOR_8_FEEDBACK: IC1102.12(VOC) LSP1102.1 ; port CONTACTOR_8_FEEDBACK
CONTACTOR_8_FEEDBACK_EXT: R1103.2 ; port CONTACTOR_8_FEEDBACK_EXT
CONTACTOR_FEEDBACK_SUPPLY_EXT: C1103.1 C1104.1 IC1101.1(OUT) IC1102.1(VDD1) R1104.2 R1105.2 R1106.2
NetD1101_1: D1101.1(K) IC1102.3(VIA) R1101.1 R1104.1
NetD1102_1: D1102.1(K) IC1102.4(VIB) R1102.1 R1105.1
NetD1103_1: D1103.1(K) IC1102.5(VIC) R1103.1 R1106.1

Not connected (* = marked no-connect by the designer): IC1102 6(NC)* 7(NC)* 11(NC)*

### Notes on the sheet
- Contactor Feedback Supply from External Supply
- (near IC1101) Pvmax <0.1W
- Contactor Feedback Isolation 6 to 8
- Fraunhofer IISB
- Schottkystr. 10
- developed by:
- 91058 Erlangen
- Germany
- Author
- Project
- License
- Description
- File
- Version
- Release Date
- Sheet
- www.foxbms.org
- www.iisb.fraunhofer.de
- foxBMS Team
- /

### Library data of the parts
C1101 C1103-C1106 = gen_C_ceramic_100n_50V_X7R_0603: MLCC; Capacitance: 100n; Rated Voltage: 50V; Dielectric: X7R; Case EIA: 0603; Case Metric: 1608; PnP Package: C_0603_10; PnP Value: 100n/50V/X7R; PnP equipped: x; Part Number: gen_C_ceramic_100n_50V_X7R_0603; Supplier 1: Farnell; Supplier Part Number 1: 2525267
C1102 = gen_C_ceramic_1u_50V_X7R_0603: MLCC; Capacitance: 1u; Rated Voltage: 50V; Dielectric: X7R; Tolerance: ± 10%; Case EIA: 0603; Case Metric: 1608; Part Number: gen_C_ceramic_1u_50V_X7R_0603; Operating Temperature: -55°C - +125°C; Supplier 1: Farnell; Supplier Part Number 1: 2779055
D1101-D1103 = CDSOD323-T05: TVS Diode, CDSOD323 Series, Unidirectional, 5 V, 18.3 V, SOD-323, 2 Pins; Manufacturer: Bourns; Breakdown Voltage: 6V; Part Number: CDSOD323-T05; Part Name: CDSOD323-T05; Operating Temperature: -55°C - +150°C; ComponentLink1Description: Datasheet; ComponentLink1URL: http://www.farnell.com/datasheets/1845299.pdf; Supplier 1: Farnell; Supplier Part Number 1: 2341914
IC1101 = CMP-2000-07341-1: Positive-Voltage Regulator, 100 mA, 0 to 125 degC, 3-Pin SOT-89 (PK), Green (RoHS & no Sb/Br), Tape and Reel; Manufacturer: TexasInstruments; Load Regulation: 60mV; Input Voltage MIN: 7V; Number of Outputs: 1; Input Voltage MAX: 20V; Output Type: Fixed; Output Current: 100mA; Output Voltage: 5V; PSRR / Ripple Rejection - Typ: 49dB; Line Regulation: 200mV; Mounting Style: SMD/SMT; Datasheet Version: Rev. U, 05/2011; Polarity: Positive; Minimum Operating Temperature: 0C; Package Reference: PK0003A; Brand: TexasInstruments; Packaging: Reel; Product Category: LinearVoltageRegulators; RoHS: True; Datasheet URL: http://www.ti.com/lit/ds/symlink/ua78l05.pdf; Package URL: http://www.ti.com/lit/ml/mhsi001b/mhsi001b.pdf; Series: UA78L05; Manufacturer URL: http://www.ti.com/; Package Description: 3-Pin Small Outline Transistor, Body 4.5 x 2.5 mm, Pitch 1.5 mm; Mounting Technology: SurfaceMount; Package / Case: SOT-89-4; Maximum Operating Temperature: +125C
IC1102 = CMP-0534-00476-1: Triple Channel Digital Isolator, Enhanced System-Level ESD Reliability, 2.5 KV rms Insulation Rating, 90 Mbps Data Rate, 32 ns Delay, Industrial, 16-pin SOIC (RW-16), Tube; Manufacturer: Analog Devices; Max Data Rate: 90Mbps; Insulation Rating (kVrms): 2.5; Max Operating Temp (degreesC): 105; ComponentLink3Description: Package Specification; ComponentLink4URL: Product URL:http://www.analog.com/en/interface-isolation/digital-isolators/adum3300/products/product.html; Code_JEDEC: MS-013-AA; PackageDescription: 16-Pin Standard Small Outline Package, Body 10.3 x 7.5 mm, Pitch 1.27 mm; ComponentLink4Description: URL Link1; ComponentLink1URL: http://www.analog.com/en/index.html; ComponentLink2URL: http://www.analog.com/static/imported-files/data_sheets/ADUM3300_3301.pdf; ComponentLink2Description: Datasheet; ComponentLink1Description: Manufacturer URL; PackageVersion: 032707-B, 03/2007; PackageReference: RW-16; PartNumber: ADUM3300CRWZ; Mounting Technology: Surface Mount; ComponentLink3URL: http://www.analog.com/static/imported-files/packages/PKG_PDF/SOIC_WIDE%20%28RW%29/RW_16.pdf; DatasheetVersion: Rev. B
LSP1101-LSP1103 = Testpoint_Square: Testpoint, square; Part Number: Testpoint_Square
R1101-R1103 = gen_R_47R_0603: SMD Resistor 47R 0603; Tolerance: 1%; Power: 0.1W; Case EIA: 0603; Case Metric: 1608; Maximum Working Voltage: 75V; PnP Package: R_0603; Part Number: gen_R_47R_0603; Operating Temperature: -55°C - +155°C; Resistance: 47R; Series: E24; PnP Value: 47R; Supplier 1: Farnell; Supplier Part Number 1: 2303030
R1104-R1106 = gen_R_10k_0603: SMD Resistor 10k 0603; Tolerance: 1%; Power: 0.1W; Case EIA: 0603; Case Metric: 1608; Maximum Working Voltage: 75V; PnP Package: R_0603; Part Number: gen_R_10k_0603; Operating Temperature: -55°C - +155°C; Resistance: 10k; Series: E24, E96; PnP Value: 10k; Supplier 1: Farnell; Supplier Part Number 1: 2073349

## Sheet contactor_connectors.SchDoc: foxBMS BMS-Extension
size A3; DocumentNumber: 6; SheetNumber: 6; SheetTotal: 14; Author: Fraunhofer IISB foxBMS Team; REL-DATE: 2017-05-16; VERSION: 1.0.2; GateName_1: G$1; SymbolName_1: FRAME_B_L; LibraryName: foxBMS_BMS-Master_V1.00_A; DeviceSetName: FRAME_B_L; GateName_2: G$2; SymbolName_2: DOCFIELD; SheetDescription: Contactor Connectors
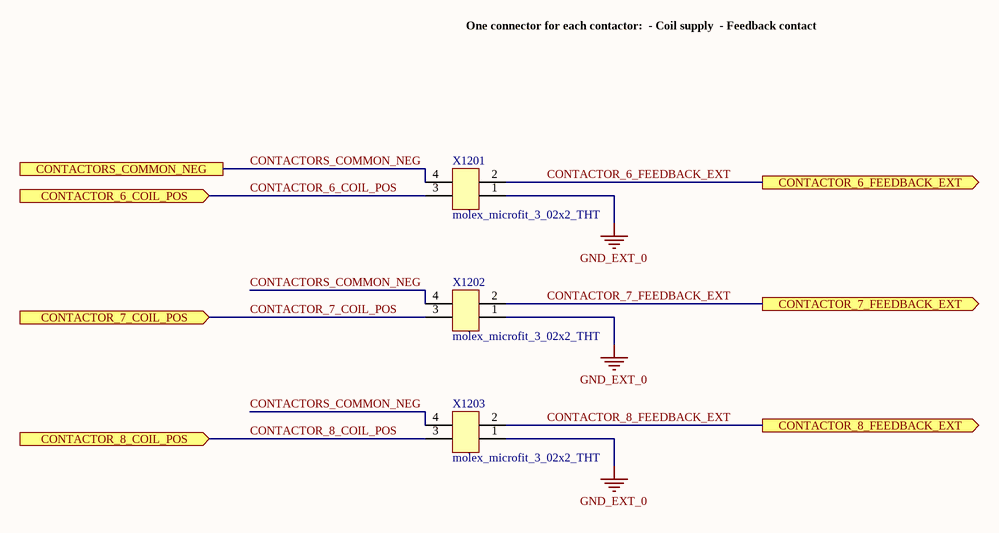
[diagram p13: contactor_connectors.SchDoc]

### Parts
X1201  molex_microfit_3_02x2_THT  [MOLEX_MICROFIT_02x2_THT]
X1202  molex_microfit_3_02x2_THT  [MOLEX_MICROFIT_02x2_THT]
X1203  molex_microfit_3_02x2_THT  [MOLEX_MICROFIT_02x2_THT]

### Ports
CONTACTOR_6_COIL_POS (in), CONTACTOR_6_FEEDBACK_EXT (out), CONTACTOR_7_COIL_POS (in), CONTACTOR_7_FEEDBACK_EXT (out), CONTACTOR_8_COIL_POS (in), CONTACTOR_8_FEEDBACK_EXT (out), CONTACTORS_COMMON_NEG

### Nets
GND_EXT_0: X1201.1 X1202.1 X1203.1
CONTACTOR_6_COIL_POS: X1201.3 ; port CONTACTOR_6_COIL_POS
CONTACTOR_6_FEEDBACK_EXT: X1201.2 ; port CONTACTOR_6_FEEDBACK_EXT
CONTACTOR_7_COIL_POS: X1202.3 ; port CONTACTOR_7_COIL_POS
CONTACTOR_7_FEEDBACK_EXT: X1202.2 ; port CONTACTOR_7_FEEDBACK_EXT
CONTACTOR_8_COIL_POS: X1203.3 ; port CONTACTOR_8_COIL_POS
CONTACTOR_8_FEEDBACK_EXT: X1203.2 ; port CONTACTOR_8_FEEDBACK_EXT
CONTACTORS_COMMON_NEG: X1201.4 X1202.4 X1203.4 ; port CONTACTORS_COMMON_NEG

### Notes on the sheet
- One connector for each contactor:
  - Coil supply
  - Feedback contact
- Fraunhofer IISB
- Schottkystr. 10
- developed by:
- 91058 Erlangen
- Germany
- Author
- Project
- License
- Description
- File
- Version
- Release Date
- Sheet
- www.foxbms.org
- www.iisb.fraunhofer.de
- foxBMS Team
- /

### Library data of the parts
X1201-X1203 = molex_microfit_3_02x2_THT: Micro-Fit 3.0 Right Angle Header, 3.00mm Pitch, Dual Row, 4 Circuits, with Snap-in Plastic Peg PCB Lock, Tin, Glow Wire Capable, Black, 43045-0400; Manufacturer: Molex; Circuits: 4; Rated Voltage: 600V; Rated Current: 8.5A; Part Number: molex_microfit_3_02x2_THT; Part Name: MicroFit; Operating Temperature: -40°C - +105°C; Supplier 1: Farnell; Supplier Part Number 1: 9733019

## Nets that join several sheets
+3.3V_0: CAN_1 (C807.2 IC803.1 R804.1), isolated_rs485 (C1306.1 IC1303.1 IC1303.7), memorycard (R1501.2 T1501.2), analog_inputs_not_isolated (C1703.1 C1704.1 IC1701.3 IC1701.4), iso_GPIO_4in_4out (6 pins), isolated_NO_contacts (6 pins), FPGA_SPI_interface (LSP2101.1 SV2101.7), connectors_to_BMS_master (JP2201.21 JP2201.23 JP2202.21 JP2202.23), contactor_control (IC1001.1 IC1002.1 IC1003.1), contactor_feedback (C1105.1 C1106.1 IC1102.10 IC1102.16)
GND_0: CAN_1 (6 pins), isolated_rs485 (C1306.2 IC1303.2 IC1303.8), memorycard (6 pins), analog_inputs_not_isolated (22 pins), iso_GPIO_4in_4out (6 pins), isolated_NO_contacts (12 pins), FPGA_SPI_interface (LSP2102.1 SV2101.3 SV2101.4), connectors_to_BMS_master (JP2201.22 JP2201.24 JP2202.22 JP2202.24), contactor_control (6 pins), contactor_feedback (C1105.2 C1106.2 IC1102.9 IC1102.15)
GND_EXT_0: interlock (SV901.8), iso_GPIO_4in_4out (20 pins), contactor_feedback (10 pins), contactor_connectors (X1201.1 X1202.1 X1203.1)
SUPPLY_EXT_0: interlock (SV901.5), iso_GPIO_4in_4out (C1901.1 C1902.1 IC1901.3), contactor_feedback (C1101.1 C1102.1 IC1101.3)
SUPPLY_EXT_2: interlock (SV901.1 SV901.3), contactor_control (F1001.2 F1002.2 F1003.2)
ADC_MCU_0_CH_0: analog_inputs_not_isolated (5 pins), connectors_to_BMS_master (JP2202.18)
ADC_MCU_0_CH_1: analog_inputs_not_isolated (5 pins), connectors_to_BMS_master (JP2202.17)
ADC_MCU_0_CH_2: analog_inputs_not_isolated (5 pins), connectors_to_BMS_master (JP2202.20)
ADC_MCU_0_CH_3: analog_inputs_not_isolated (5 pins), connectors_to_BMS_master (JP2202.19)
ADC_MCU_0_CH_4: analog_inputs_not_isolated (5 pins), connectors_to_BMS_master (JP2202.15)
CAN_1_RX: CAN_1 (IC803.5 LSP806.1), connectors_to_BMS_master (JP2201.20)
CAN_1_TRANS_STANDBY_CONTROL: CAN_1 (R806.2), connectors_to_BMS_master (JP2201.19)
CAN_1_TX: CAN_1 (IC803.3 LSP805.1), connectors_to_BMS_master (JP2201.17)
CONTACTOR_6_COIL_POS: contactor_control (D1001.1 IC1001.5), contactor_connectors (X1201.3)
CONTACTOR_6_CONTROL: connectors_to_BMS_master (JP2201.8), contactor_control (LSP1001.1 R1001.2)
CONTACTOR_6_FEEDBACK: connectors_to_BMS_master (JP2201.7), contactor_feedback (IC1102.14 LSP1101.1)
CONTACTOR_6_FEEDBACK_EXT: contactor_feedback (R1101.2), contactor_connectors (X1201.2)
CONTACTOR_7_COIL_POS: contactor_control (D1002.1 IC1002.5), contactor_connectors (X1202.3)
CONTACTOR_7_CONTROL: connectors_to_BMS_master (JP2201.10), contactor_control (LSP1002.1 R1004.2)
CONTACTOR_7_FEEDBACK: connectors_to_BMS_master (JP2201.9), contactor_feedback (IC1102.13 LSP1103.1)
CONTACTOR_7_FEEDBACK_EXT: contactor_feedback (R1102.2), contactor_connectors (X1202.2)
CONTACTOR_8_COIL_POS: contactor_control (D1003.1 IC1003.5), contactor_connectors (X1203.3)
CONTACTOR_8_CONTROL: connectors_to_BMS_master (JP2202.16), contactor_control (LSP1003.1 R1007.2)
CONTACTOR_8_FEEDBACK: connectors_to_BMS_master (JP2202.13), contactor_feedback (IC1102.12 LSP1102.1)
CONTACTOR_8_FEEDBACK_EXT: contactor_feedback (R1103.2), contactor_connectors (X1203.2)
CONTACTORS_COMMON_NEG: interlock (T901.4), contactor_control (D1001.2 D1002.2 D1003.2), contactor_connectors (X1201.4 X1202.4 X1203.4)
DATA_STORAGE_SPI_Memorycard_NSS: memorycard (LSP1502.1 R1506.1 SLOT1501.2), connectors_to_BMS_master (JP2201.1)
DATA_STORAGE_SPI_MISO: memorycard (LSP1505.1 R1507.1 SLOT1501.7), connectors_to_BMS_master (JP2201.3)
DATA_STORAGE_SPI_MOSI: memorycard (LSP1503.1 R1504.1 SLOT1501.3), connectors_to_BMS_master (JP2201.5)
DATA_STORAGE_SPI_SCK: memorycard (LSP1504.1 R1505.2 SLOT1501.5), connectors_to_BMS_master (JP2201.6)
ISO_GPIO_MCU_0_IN_0: iso_GPIO_4in_4out (IC1902.14 LSP1903.1), connectors_to_BMS_master (JP2202.4)
ISO_GPIO_MCU_0_IN_1: iso_GPIO_4in_4out (IC1902.13 LSP1901.1), connectors_to_BMS_master (JP2202.1)
ISO_GPIO_MCU_0_IN_2: iso_GPIO_4in_4out (IC1903.14 LSP1905.1), connectors_to_BMS_master (JP2201.11)
ISO_GPIO_MCU_0_IN_3: iso_GPIO_4in_4out (IC1903.13 LSP1907.1), connectors_to_BMS_master (JP2201.16)
ISO_GPIO_MCU_0_OUT_0: iso_GPIO_4in_4out (IC1902.12 LSP1904.1), connectors_to_BMS_master (JP2201.15)
ISO_GPIO_MCU_0_OUT_1: iso_GPIO_4in_4out (IC1902.11 LSP1902.1), connectors_to_BMS_master (JP2201.12)
ISO_GPIO_MCU_0_OUT_2: iso_GPIO_4in_4out (IC1903.12 LSP1906.1), connectors_to_BMS_master (JP2201.13)
ISO_GPIO_MCU_0_OUT_3: iso_GPIO_4in_4out (IC1903.11 LSP1908.1), connectors_to_BMS_master (JP2201.14)
ISONOC_0_CONTROL: isolated_NO_contacts (LSP2001.1 R2001.2), connectors_to_BMS_master (JP2202.10)
ISONOC_1_CONTROL: isolated_NO_contacts (LSP2003.1 R2007.2), connectors_to_BMS_master (JP2202.7)
ISONOC_2_CONTROL: isolated_NO_contacts (LSP2005.1 R2013.2), connectors_to_BMS_master (JP2202.8)
ISONOC_3_CONTROL: isolated_NO_contacts (LSP2002.1 R2002.2), connectors_to_BMS_master (JP2202.5)
ISONOC_4_CONTROL: isolated_NO_contacts (LSP2004.1 R2008.2), connectors_to_BMS_master (JP2202.6)
ISONOC_5_CONTROL: isolated_NO_contacts (LSP2006.1 R2014.2), connectors_to_BMS_master (JP2202.3)
Memorycard_SUPPLY_CONTROL: memorycard (LSP1501.1 R1501.1 T1501.1), connectors_to_BMS_master (JP2201.4)
RS485_MCU_0_DE: isolated_rs485 (IC1303.5 LSP1302.1), connectors_to_BMS_master (JP2202.9)
RS485_MCU_0_NRE: isolated_rs485 (IC1303.4 LSP1303.1), connectors_to_BMS_master (JP2202.12)
RS485_MCU_0_RX: isolated_rs485 (IC1303.6 LSP1304.1), connectors_to_BMS_master (JP2202.11)
RS485_MCU_0_TX: isolated_rs485 (IC1303.3 LSP1301.1), connectors_to_BMS_master (JP2202.14)

## Assembly variants
default: not fitted D1001 D1002 D1003 D2001 D2002 D2003 D2004 D2005 D2006 SV2101